# Altium schematic sheet IF_SEL.SchDoc
size A4 portrait; CompanyName: FairWaves LLC; DrawnBy: Andrey Sviyazov; DocumentNumber: 4; Revision: 1; SheetNumber: 4; SheetTotal: 5
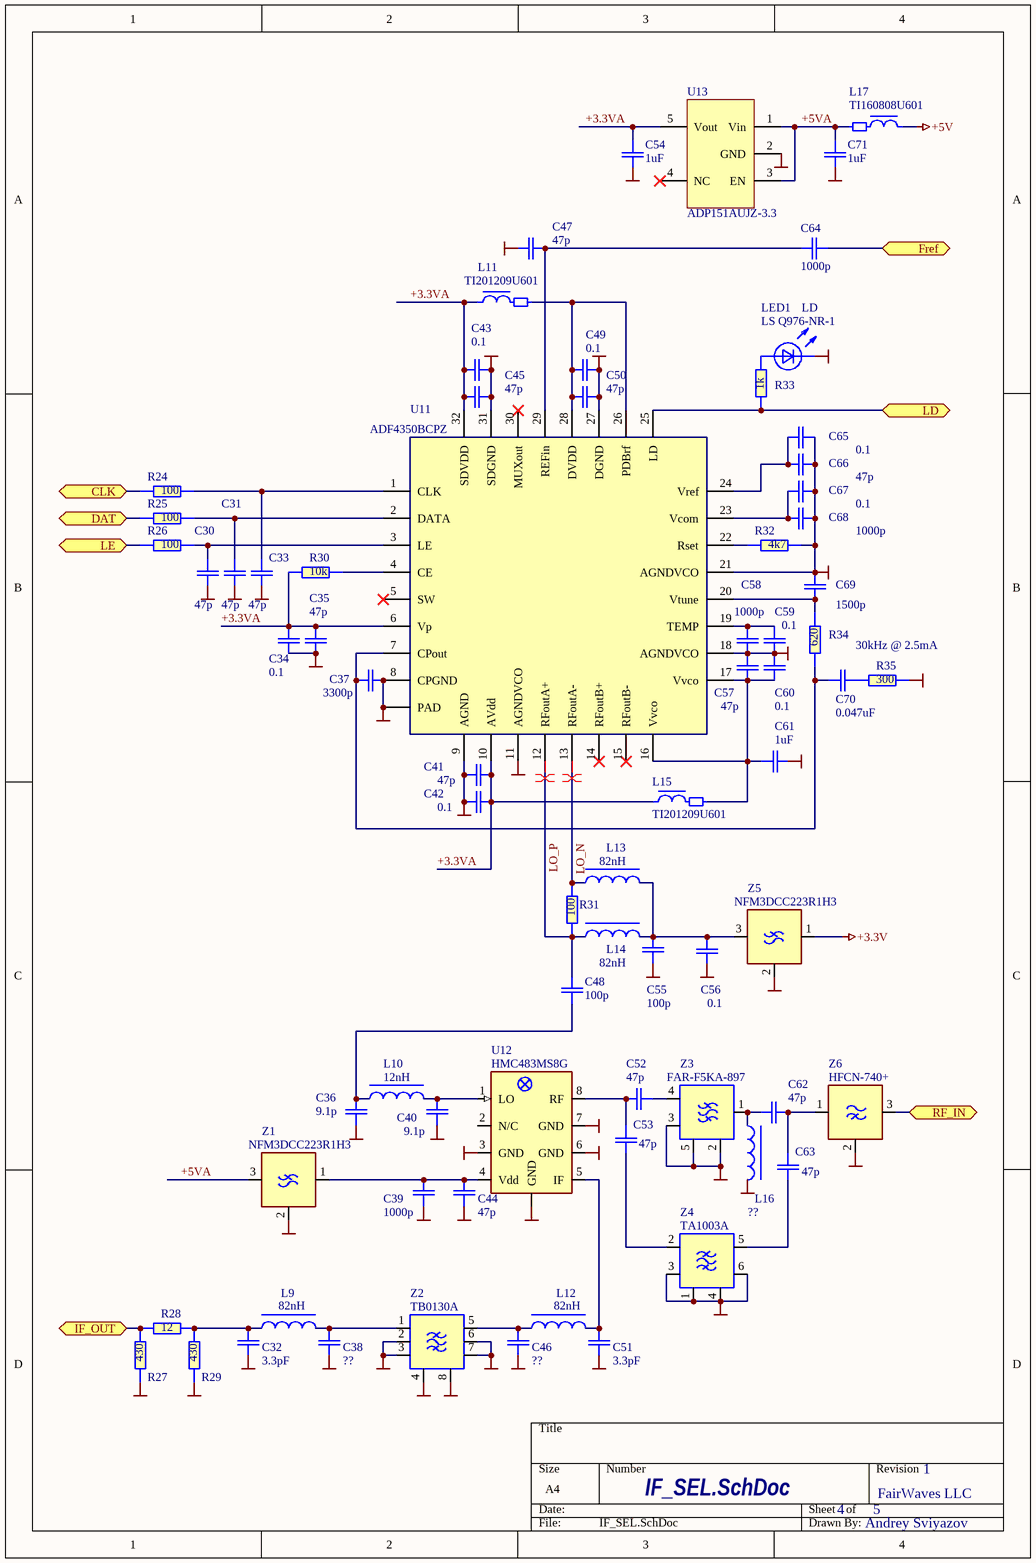
[diagram p0: IF_SEL.SchDoc]

## Parts
C30  47p  [C0603-Phillips]
C31  47p  [C0603-Phillips]
C32  3.3pF  [C0603-Phillips]
C33  47p  [C0603-Phillips]
C34  0.1  [C0603-Phillips]
C35  47p  [C0603-Phillips]
C36  9.1p  [C0603-Phillips]
C37  3300p  [C0603-Phillips]
C38  ??  [C0603-Phillips]
C39  1000p  [C0603-Phillips]
C40  9.1p  [C0603-Phillips]
C41  47p  [C0603-Phillips]
C42  0.1  [C0603-Phillips]
C43  0.1  [C0603-Phillips]
C44  47p  [C0603-Phillips]
C45  47p  [C0603-Phillips]
C46  ??  [C0603-Phillips]
C47  47p  [C0603-Phillips]
C48  100p  [C0603-Phillips]
C49  0.1  [C0603-Phillips]
C50  47p  [C0603-Phillips]
C51  3.3pF  [C0603-Phillips]
C52  47p  [C0603-Phillips]
C53  47p  [C0603-Phillips]
C54  1uF  [C0603-Phillips]
C55  100p  [C0603-Phillips]
C56  0.1  [C0603-Phillips]
C57  47p  [C0603-Phillips]
C58  1000p  [C0603-Phillips]
C59  0.1  [C0603-Phillips]
C60  0.1  [C0603-Phillips]
C61  1uF  [C0603-Phillips]
C62  47p  [C0603-Phillips]
C63  47p  [C0603-Phillips]
C64  1000p  [C0603-Phillips]
C65  0.1  [C0603-Phillips]
C66  47p  [C0603-Phillips]
C67  0.1  [C0603-Phillips]
C68  1000p  [C0603-Phillips]
C69  1500p  [C0603-Phillips]
C70  0.047uF  [C0603-Phillips]
C71  1uF  [C0603-Phillips]
L9  82nH  [TF160808-Phillips]
L10  12nH  [TF160808-Phillips]
L11  TI201209U601  [TI2012-Phillips]
L12  82nH  [TF160808-Phillips]
L13  82nH  [TF160808-Phillips]
L14  82nH  [TF160808-Phillips]
L15  TI201209U601  [TI2012-Phillips]
L16  ??  [TF160808-Phillips]
L17  TI160808U601  [Ti160808-Phillips]
LED1  LS Q976-NR-1  Misc: LD  [LED-0603y]
R24  100  [R0603-PHILLIPS]
R25  100  [R0603-PHILLIPS]
R26  100  [R0603-PHILLIPS]
R27  430  [R0603-PHILLIPS]
R28  12  [R0603-PHILLIPS]
R29  430  [R0603-PHILLIPS]
R30  10k  [R0603-PHILLIPS]
R31  100  [R0603-PHILLIPS]
R32  4k7  [R0603-PHILLIPS]
R33  1k  [R0603-PHILLIPS]
R34  620  [R0603-PHILLIPS]
R35  300  [R0603-PHILLIPS]
U11  ADF4350BCPZ  [CP-32-2]
U12  HMC483MS8G  [MS8G]
U13  ADP151AUJZ-3.3  [SOT-23-5[3.1x1.8/0.95]]
Z1  NFM3DCC223R1H3  [NFM3DC]
Z2  TB0130A  [DCC8_5x5]
Z3  FAR-F5KA-897  [SAW-1.4x1x0.5mm]
Z4  TA1003A  [DCC6C_L]
Z5  NFM3DCC223R1H3  [NFM3DC]
Z6  HFCN-740+  [LFCN-HFCN]

## Ports
CLK, DAT, Fref, IF_OUT, LD, LE, RF_IN

## Nets
+3.3V: Z5.1
+5V: L17.1
GND: C30.1 C31.1 C32.1 C33.1 C34.1 C35.1 C36.2 C37.1 C38.1 C39.2 C40.2 C41.2 C42.2 C43.2 C44.2 C45.2 C46.1 C47.1 C49.2 C50.2 C51.1 C54.1 C55.2 C56.1 C57.2 C58.1 C59.1 C60.2 C61.1 C65.2 C66.2 C67.2 C68.2 C69.2 C71.1 L16.2 LED1.1(K) R27.1 R29.1 R32.2 R35.2 U11.0(PAD) U11.8(CPGND) U11.9(AGND) U11.11(AGNDVCO) U11.18(AGNDVCO) U11.21(AGNDVCO) U11.27(DGND) U11.31(SDGND) U12.0(GND) U12.3(GND) U12.6(GND) U12.7(GND) U13.2(GND) Z1.2 Z2.2(In2) Z2.3(In3) Z2.4(Gnd) Z2.6(Out2) Z2.7(Out3) Z2.8(Gnd) Z3.2(GND) Z3.3(~{Out}) Z3.5(GND) Z4.1(GND) Z4.3(GND) Z4.4(GND) Z4.6(GND) Z5.2 Z6.2
+3.3VA: C34.2 C35.2 C41.1 C42.1 C43.1 C45.1 C54.2 L11.1 L15.1 R30.1 U11.6(Vp) U11.10(AVdd) U11.32(SDVDD) U13.5(Vout)
+5VA: C71.2 L17.2 U13.1(Vin) U13.3(EN) Z1.3
CLK: R24.1 ; port CLK
DAT: R25.1 ; port DAT
Fref: C64.2 ; port Fref
IF_OUT: R27.2 R28.1 ; port IF_OUT
LD: R33.1 U11.25(LD) ; port LD
LE: R26.1 ; port LE
LO_N: L13.1 R31.2 U11.13(RFoutA-)
LO_P: C48.1 L14.1 R31.1 U11.12(RFoutA+)
RF_IN: Z6.3 ; port RF_IN
NetC30_2: C30.2 R26.2 U11.3(LE)
NetC31_2: C31.2 R25.2 U11.2(DATA)
NetC32_2: C32.2 L9.1 R28.2 R29.2
NetC33_2: C33.2 R24.2 U11.1(CLK)
NetC36_1: C36.1 C48.2 L10.2
NetC37_2: C37.2 C70.2 R34.1 U11.7(CPout)
NetC38_2: C38.2 L9.2 Z2.1(IN1)
NetC39_1: C39.1 C44.1 U12.4(Vdd) Z1.1
NetC40_1: C40.1 L10.1 U12.1(LO)
NetC46_2: C46.2 L12.1 Z2.5(Out1)
NetC47_2: C47.2 C64.1 U11.29(REFin)
NetC49_1: C49.1 C50.1 L11.2 U11.26(PDBrf) U11.28(DVDD)
NetC51_2: C51.2 L12.2 U12.5(IF)
NetC52_1: C52.1 C53.2 U12.8(RF)
NetC52_2: C52.2 Z3.4(Out)
NetC53_1: C53.1 Z4.2(IN)
NetC55_1: C55.1 C56.2 L13.2 L14.2 Z5.3
NetC57_1: C57.1 C60.1 C61.2 L15.2 U11.16(Vvco) U11.17(Vvco)
NetC58_2: C58.2 C59.2 U11.19(TEMP)
NetC62_1: C62.1 L16.1 Z3.1(IN)
NetC62_2: C62.2 C63.2 Z6.1
NetC63_1: C63.1 Z4.5(Out)
NetC65_1: C65.1 C66.1 U11.24(Vref)
NetC67_1: C67.1 C68.1 U11.23(Vcom)
NetC69_1: C69.1 R34.2 U11.20(Vtune)
NetC70_1: C70.1 R35.1
NetLED1_2: LED1.2(A) R33.2
NetR30_2: R30.2 U11.4(CE)
NetR32_1: R32.1 U11.22(Rset)

Not connected (* = marked no-connect by the designer): U11 5(SW)* 14(RFoutB+)* 15(RFoutB-)* 30(MUXout)*; U12 2(N/C); U13 4(NC)*

## Layout directives
differential pair: LO_N, LO_P

## Notes on the sheet
- 30kHz @ 2.5mA

## Library data of the parts
C30-C33 C35-C41 C44-C48 C50-C53 C55 C57 C58 C62-C64 C66 C68 C69 = C0603: Capacitor; Manufacturer: MURATA; Tolerance: 20%; Name: SMD0603; U/P/TKE: NP0
  C30 C31 C33 C35 C41 C44 C45 C47 C50 C52 C53 C57 C62 C63 C66: Value: 47p
  C32 C51: Value: 3.3pF
  C36 C40: Value: 9.1p
  C37: Value: 3300p
  C38 C46: Value: ??
  C39 C58 C64 C68: Value: 1000p
  C48 C55: Value: 100p
  C69: Value: 1500p
C34 C42 C43 C49 C54 C56 C59-C61 C65 C67 C71 = C0603: Capacitor; Manufacturer: MURATA; Tolerance: 20%; Name: SMD0603; U/P/TKE: Y5V
  C34 C42 C43 C49 C56 C59 C60 C65 C67: Value: 0.1
  C54 C61 C71: Value: 1uF
C70 = C0603: Capacitor; Manufacturer: MURATA; Tolerance: 20%; Name: SMD0603; U/P/TKE: X5R; Value: 0.047uF
L9 L10 L12-L14 L16 = TF160808: Coil; Manufacturer: SMD; Name: TF160808
  L9 L12-L14: Value: 82nH
  L10: Value: 12nH
  L16: Value: ??
L11 L15 = TI2012_1: Choke; Manufacturer: MURATA; Name: TI201209U601; Value: *
L17 = TI160808: Choke; Manufacturer: MURATA; Name: TI160808U601; Value: *
LED1 = LED0603: LED SMD; Manufacturer: OSRAM Opto Semi; Name: LS Q976-NR-1
R24-R35 = R0603: Resistor; Manufacturer: YAGEO; Tolerance: 5%; Name: SMD0603; U/P/TKE: 0.1W
  R24-R26 R31: Value: 100
  R27 R29: Value: 430
  R28: Value: 12
  R30: Value: 10k
  R32: Value: 4k7
  R33: Value: 1k
  R34: Value: 620
  R35: Value: 300
U11 = ADF4350BCPZ: IC; Manufacturer: Analog Devices; Misc: RF Synthesizer with VCO; Swap: No; Name: ADF4350BCPZ
U12 = HMC483_5MS8G: IC; Manufacturer: Hittite; Swap: No; Misc: High IP3 Mixer with  LO Amp; Name: HMC483MS8G
U13 = ADP151AUJZ: IC; Manufacturer: AD; Name: ADP151AUJZ-3.3
Z1 Z5 = NFM3DC: EMI_FILTER; Manufacturer: Murata; Value: 22nF; PDF: D:\Proj\Components\Murata\EMI Suppression Filters.pdf; Name: NFM3DCC223R1H3; Misc: EMI_FILTER
Z2 = SAW 5x5-8 SMD: SAW filter; Manufacturer: Tai-SAW; Misc: Low-Loss IF Filter for Mobile Communication; Name: TB0130A
Z3 = SAW 1.4x1.0-5 SMD: SAW Filter; Manufacturer: Taiyo Yuden; Misc: Low-Loss Filter for Mobile Communication; Name: FAR-F5KA-897
Z4 = SAW 3x3 SMD: SAW filter; Manufacturer: Tai-SAW; Misc: Low-Loss Filter for Mobile Communication; Name: TA1003A
Z6 = HFCN-2700: High pass filter; Manufacturer: MiniCircuits; Misc: HPF-740МГц; Name: HFCN-740+; Value: HFCN-740+